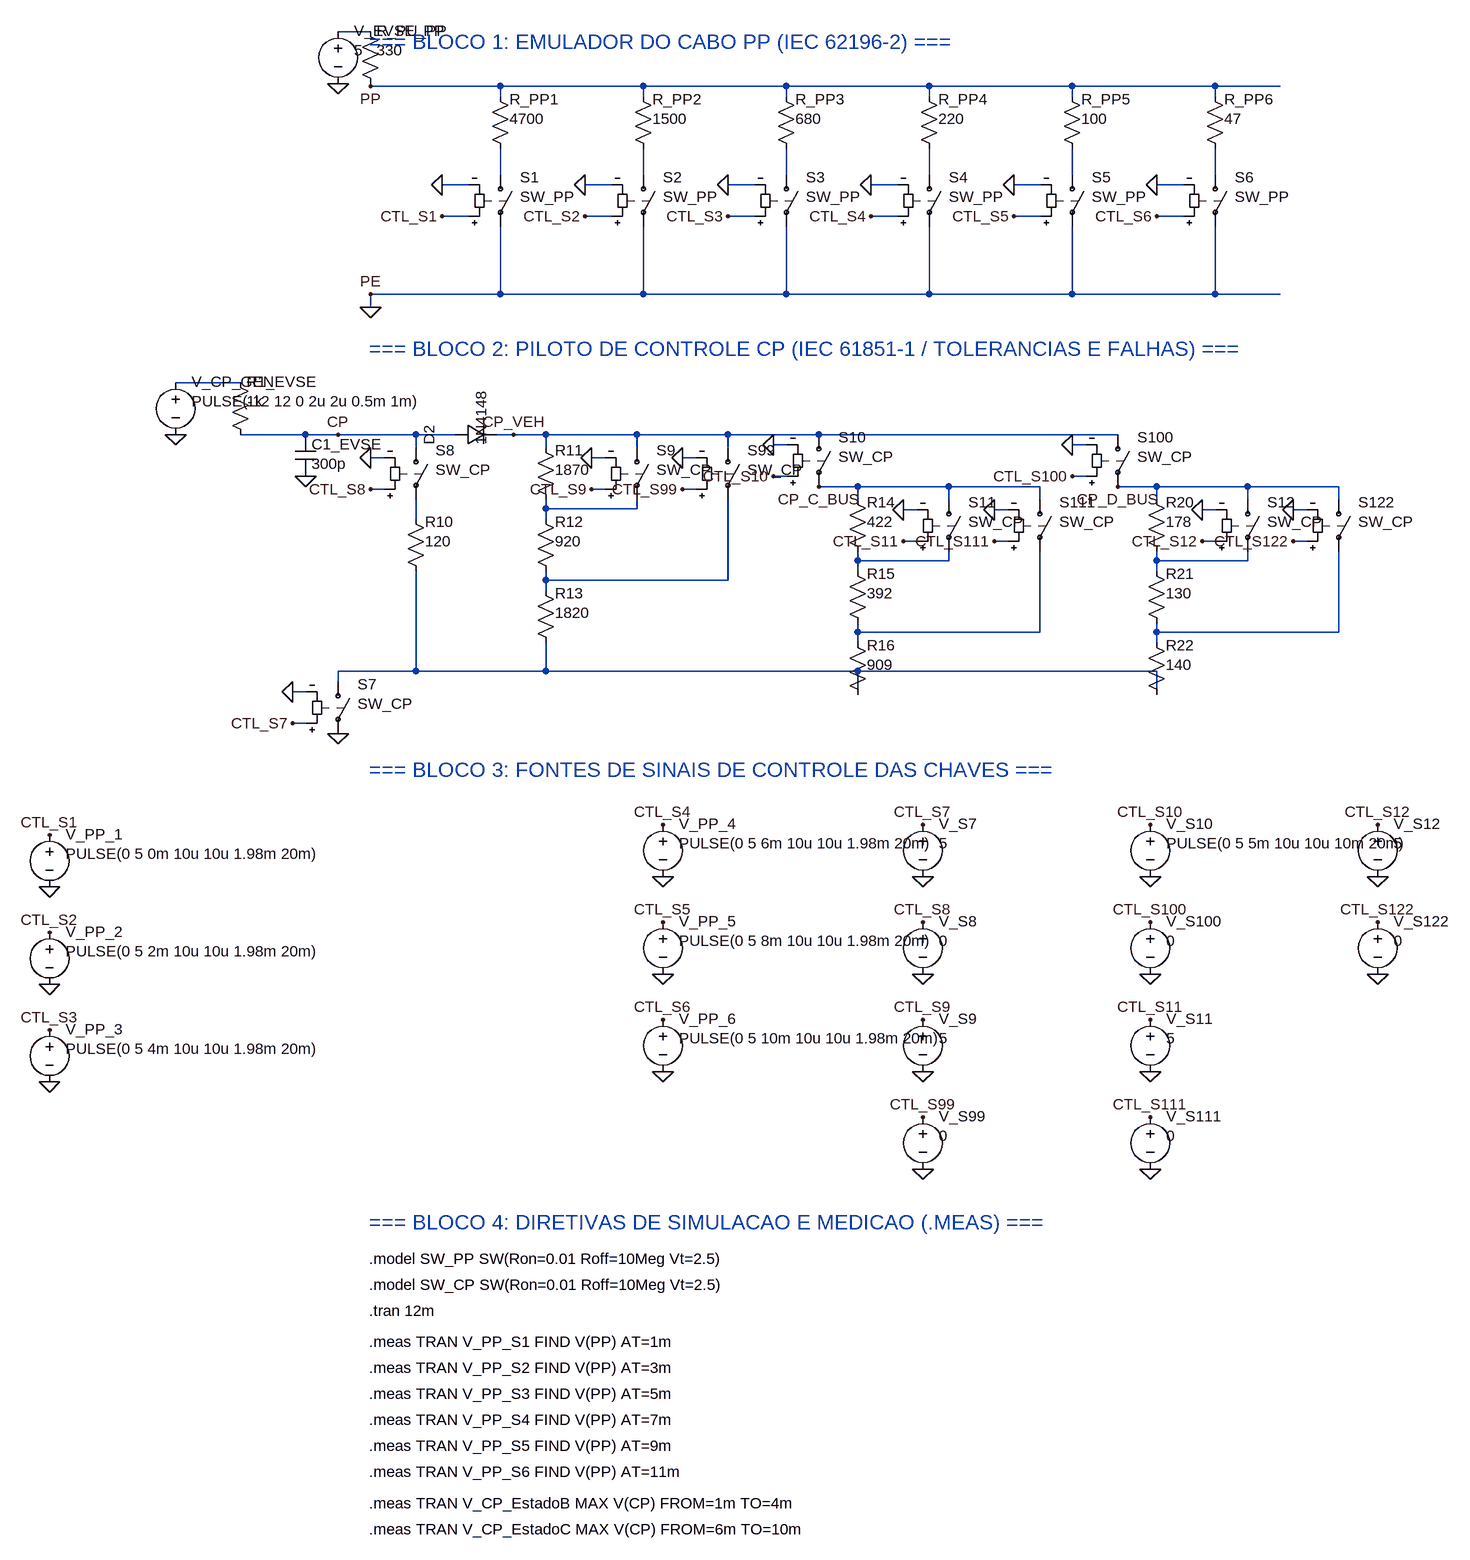
[diagram p0: schematic Teste.asc]
Teste.asc, the LTspice schematic file:
Version 4.1
SHEET 1 3600 2400
WIRE 50 16 0 16
WIRE 50 100 50 96
WIRE 250 100 50 100
WIRE 470 100 250 100
WIRE 690 100 470 100
WIRE 910 100 690 100
WIRE 1130 100 910 100
WIRE 1350 100 1130 100
WIRE 1450 100 1350 100
WIRE 250 116 250 100
WIRE 470 116 470 100
WIRE 690 116 690 100
WIRE 910 116 910 100
WIRE 1130 116 1130 100
WIRE 1350 116 1350 100
WIRE 250 236 250 196
WIRE 470 236 470 196
WIRE 690 236 690 196
WIRE 910 236 910 196
WIRE 1130 236 1130 196
WIRE 1350 236 1350 196
WIRE 202 252 160 252
WIRE 422 252 380 252
WIRE 642 252 600 252
WIRE 862 252 820 252
WIRE 1082 252 1040 252
WIRE 1302 252 1260 252
WIRE 202 300 160 300
WIRE 422 300 380 300
WIRE 642 300 600 300
WIRE 862 300 820 300
WIRE 1082 300 1040 300
WIRE 1302 300 1260 300
WIRE 250 420 250 316
WIRE 250 420 50 420
WIRE 470 420 470 316
WIRE 470 420 250 420
WIRE 690 420 690 316
WIRE 690 420 470 420
WIRE 910 420 910 316
WIRE 910 420 690 420
WIRE 1130 420 1130 316
WIRE 1130 420 910 420
WIRE 1350 420 1350 316
WIRE 1350 420 1130 420
WIRE 1450 420 1350 420
WIRE 50 440 50 420
WIRE -150 556 -250 556
WIRE -50 636 -150 636
WIRE 0 636 -50 636
WIRE 120 636 0 636
WIRE 180 636 120 636
WIRE 270 636 244 636
WIRE 320 636 270 636
WIRE 460 636 320 636
WIRE 600 636 460 636
WIRE 740 636 600 636
WIRE 1200 636 740 636
WIRE 692 652 670 652
WIRE 1152 652 1130 652
WIRE 120 656 120 636
WIRE 320 656 320 636
WIRE 460 656 460 636
WIRE 600 656 600 636
WIRE 72 672 50 672
WIRE 412 672 390 672
WIRE 552 672 530 672
WIRE 692 700 670 700
WIRE 1152 700 1130 700
WIRE 800 716 740 716
WIRE 940 716 800 716
WIRE 1080 716 940 716
WIRE 1260 716 1200 716
WIRE 1400 716 1260 716
WIRE 1540 716 1400 716
WIRE 72 720 50 720
WIRE 412 720 390 720
WIRE 552 720 530 720
WIRE 800 736 800 716
WIRE 940 736 940 716
WIRE 1080 736 1080 716
WIRE 1260 736 1260 716
WIRE 1400 736 1400 716
WIRE 1540 736 1540 716
WIRE 320 750 320 736
WIRE 460 750 460 736
WIRE 460 750 320 750
WIRE 892 752 870 752
WIRE 1032 752 1010 752
WIRE 1352 752 1330 752
WIRE 1492 752 1470 752
WIRE 120 766 120 736
WIRE 320 766 320 750
WIRE 892 800 870 800
WIRE 1032 800 1010 800
WIRE 1352 800 1330 800
WIRE 1492 800 1470 800
WIRE 800 830 800 816
WIRE 940 830 940 816
WIRE 940 830 800 830
WIRE 1260 830 1260 816
WIRE 1400 830 1400 816
WIRE 1400 830 1260 830
WIRE 800 846 800 830
WIRE 1260 846 1260 830
WIRE 320 860 320 846
WIRE 600 860 600 736
WIRE 600 860 320 860
WIRE 320 876 320 860
WIRE 800 940 800 926
WIRE 1080 940 1080 816
WIRE 1080 940 800 940
WIRE 1260 940 1260 926
WIRE 1540 940 1540 816
WIRE 1540 940 1260 940
WIRE 800 956 800 940
WIRE 1260 956 1260 940
WIRE 120 1000 120 846
WIRE 120 1000 0 1000
WIRE 320 1000 320 956
WIRE 320 1000 120 1000
WIRE 800 1000 320 1000
WIRE 1260 1000 800 1000
WIRE 0 1016 0 1000
WIRE -48 1032 -70 1032
WIRE 800 1036 800 1000
WIRE 1260 1036 1260 1000
WIRE -48 1080 -70 1080
FLAG 50 100 PP
FLAG 0 96 0
FLAG 50 420 PE
FLAG 50 440 0
FLAG 160 300 CTL_S1
FLAG 160 252 0
FLAG 380 300 CTL_S2
FLAG 380 252 0
FLAG 600 300 CTL_S3
FLAG 600 252 0
FLAG 820 300 CTL_S4
FLAG 820 252 0
FLAG 1040 300 CTL_S5
FLAG 1040 252 0
FLAG 1260 300 CTL_S6
FLAG 1260 252 0
FLAG -250 636 0
FLAG 0 636 CP
FLAG -50 700 0
FLAG 50 720 CTL_S8
FLAG 50 672 0
FLAG 270 636 CP_VEH
FLAG 0 1096 0
FLAG -70 1080 CTL_S7
FLAG -70 1032 0
FLAG 390 720 CTL_S9
FLAG 390 672 0
FLAG 530 720 CTL_S99
FLAG 530 672 0
FLAG 740 716 CP_C_BUS
FLAG 670 700 CTL_S10
FLAG 670 652 0
FLAG 1200 716 CP_D_BUS
FLAG 1130 700 CTL_S100
FLAG 1130 652 0
FLAG 870 800 CTL_S11
FLAG 870 752 0
FLAG 1010 800 CTL_S111
FLAG 1010 752 0
FLAG 1330 800 CTL_S12
FLAG 1330 752 0
FLAG 1470 800 CTL_S122
FLAG 1470 752 0
FLAG -444 1252 CTL_S1
FLAG -444 1332 0
FLAG -444 1402 CTL_S2
FLAG -444 1482 0
FLAG -444 1552 CTL_S3
FLAG -444 1632 0
FLAG 500 1236 CTL_S4
FLAG 500 1316 0
FLAG 500 1386 CTL_S5
FLAG 500 1466 0
FLAG 500 1536 CTL_S6
FLAG 500 1616 0
FLAG 900 1236 CTL_S7
FLAG 900 1316 0
FLAG 900 1386 CTL_S8
FLAG 900 1466 0
FLAG 900 1536 CTL_S9
FLAG 900 1616 0
FLAG 900 1686 CTL_S99
FLAG 900 1766 0
FLAG 1250 1236 CTL_S10
FLAG 1250 1316 0
FLAG 1250 1386 CTL_S100
FLAG 1250 1466 0
FLAG 1250 1536 CTL_S11
FLAG 1250 1616 0
FLAG 1250 1686 CTL_S111
FLAG 1250 1766 0
FLAG 1600 1236 CTL_S12
FLAG 1600 1316 0
FLAG 1600 1386 CTL_S122
FLAG 1600 1466 0
SYMBOL voltage 0 0 R0
WINDOW 0 25 15 Left 2
WINDOW 3 25 45 Left 2
SYMATTR InstName V_EVSE_PP
SYMATTR Value 5
SYMBOL res 34 0 R0
WINDOW 0 25 15 Left 2
WINDOW 3 25 45 Left 2
SYMATTR InstName R_PU_PP
SYMATTR Value 330
SYMBOL res 234 100 R0
WINDOW 0 30 20 Left 2
WINDOW 3 30 50 Left 2
SYMATTR InstName R_PP1
SYMATTR Value 4700
SYMBOL sw 250 220 R0
WINDOW 0 30 20 Left 2
WINDOW 3 30 50 Left 2
SYMATTR InstName S1
SYMATTR Value SW_PP
SYMBOL res 454 100 R0
WINDOW 0 30 20 Left 2
WINDOW 3 30 50 Left 2
SYMATTR InstName R_PP2
SYMATTR Value 1500
SYMBOL sw 470 220 R0
WINDOW 0 30 20 Left 2
WINDOW 3 30 50 Left 2
SYMATTR InstName S2
SYMATTR Value SW_PP
SYMBOL res 674 100 R0
WINDOW 0 30 20 Left 2
WINDOW 3 30 50 Left 2
SYMATTR InstName R_PP3
SYMATTR Value 680
SYMBOL sw 690 220 R0
WINDOW 0 30 20 Left 2
WINDOW 3 30 50 Left 2
SYMATTR InstName S3
SYMATTR Value SW_PP
SYMBOL res 894 100 R0
WINDOW 0 30 20 Left 2
WINDOW 3 30 50 Left 2
SYMATTR InstName R_PP4
SYMATTR Value 220
SYMBOL sw 910 220 R0
WINDOW 0 30 20 Left 2
WINDOW 3 30 50 Left 2
SYMATTR InstName S4
SYMATTR Value SW_PP
SYMBOL res 1114 100 R0
WINDOW 0 30 20 Left 2
WINDOW 3 30 50 Left 2
SYMATTR InstName R_PP5
SYMATTR Value 100
SYMBOL sw 1130 220 R0
WINDOW 0 30 20 Left 2
WINDOW 3 30 50 Left 2
SYMATTR InstName S5
SYMATTR Value SW_PP
SYMBOL res 1334 100 R0
WINDOW 0 30 20 Left 2
WINDOW 3 30 50 Left 2
SYMATTR InstName R_PP6
SYMATTR Value 47
SYMBOL sw 1350 220 R0
WINDOW 0 30 20 Left 2
WINDOW 3 30 50 Left 2
SYMATTR InstName S6
SYMATTR Value SW_PP
SYMBOL voltage -250 540 R0
WINDOW 0 25 15 Left 2
WINDOW 3 25 45 Left 2
SYMATTR InstName V_CP_GEN
SYMATTR Value PULSE(-12 12 0 2u 2u 0.5m 1m)
SYMBOL res -166 540 R0
WINDOW 0 25 15 Left 2
WINDOW 3 25 45 Left 2
SYMATTR InstName R1_EVSE
SYMATTR Value 1k
SYMBOL cap -66 636 R0
WINDOW 0 25 15 Left 2
WINDOW 3 25 45 Left 2
SYMATTR InstName C1_EVSE
SYMATTR Value 300p
SYMBOL sw 120 640 R0
WINDOW 0 30 20 Left 2
WINDOW 3 30 50 Left 2
SYMATTR InstName S8
SYMATTR Value SW_CP
SYMBOL res 104 750 R0
WINDOW 0 30 20 Left 2
WINDOW 3 30 50 Left 2
SYMATTR InstName R10
SYMATTR Value 120
SYMBOL diode 180 652 R270
WINDOW 0 0 -40 Left 2
WINDOW 3 0 40 Left 2
SYMATTR InstName D2
SYMATTR Value 1N4148
SYMBOL sw 0 1000 R0
WINDOW 0 30 20 Left 2
WINDOW 3 30 50 Left 2
SYMATTR InstName S7
SYMATTR Value SW_CP
SYMBOL res 304 640 R0
WINDOW 0 30 20 Left 2
WINDOW 3 30 50 Left 2
SYMATTR InstName R11
SYMATTR Value 1870
SYMBOL res 304 750 R0
WINDOW 0 30 20 Left 2
WINDOW 3 30 50 Left 2
SYMATTR InstName R12
SYMATTR Value 920
SYMBOL res 304 860 R0
WINDOW 0 30 20 Left 2
WINDOW 3 30 50 Left 2
SYMATTR InstName R13
SYMATTR Value 1820
SYMBOL sw 460 640 R0
WINDOW 0 30 20 Left 2
WINDOW 3 30 50 Left 2
SYMATTR InstName S9
SYMATTR Value SW_CP
SYMBOL sw 600 640 R0
WINDOW 0 30 20 Left 2
WINDOW 3 30 50 Left 2
SYMATTR InstName S99
SYMATTR Value SW_CP
SYMBOL sw 740 620 R0
WINDOW 0 30 20 Left 2
WINDOW 3 30 50 Left 2
SYMATTR InstName S10
SYMATTR Value SW_CP
SYMBOL sw 1200 620 R0
WINDOW 0 30 20 Left 2
WINDOW 3 30 50 Left 2
SYMATTR InstName S100
SYMATTR Value SW_CP
SYMBOL res 784 720 R0
WINDOW 0 30 20 Left 2
WINDOW 3 30 50 Left 2
SYMATTR InstName R14
SYMATTR Value 422
SYMBOL res 784 830 R0
WINDOW 0 30 20 Left 2
WINDOW 3 30 50 Left 2
SYMATTR InstName R15
SYMATTR Value 392
SYMBOL res 784 940 R0
WINDOW 0 30 20 Left 2
WINDOW 3 30 50 Left 2
SYMATTR InstName R16
SYMATTR Value 909
SYMBOL sw 940 720 R0
WINDOW 0 30 20 Left 2
WINDOW 3 30 50 Left 2
SYMATTR InstName S11
SYMATTR Value SW_CP
SYMBOL sw 1080 720 R0
WINDOW 0 30 20 Left 2
WINDOW 3 30 50 Left 2
SYMATTR InstName S111
SYMATTR Value SW_CP
SYMBOL res 1244 720 R0
WINDOW 0 30 20 Left 2
WINDOW 3 30 50 Left 2
SYMATTR InstName R20
SYMATTR Value 178
SYMBOL res 1244 830 R0
WINDOW 0 30 20 Left 2
WINDOW 3 30 50 Left 2
SYMATTR InstName R21
SYMATTR Value 130
SYMBOL res 1244 940 R0
WINDOW 0 30 20 Left 2
WINDOW 3 30 50 Left 2
SYMATTR InstName R22
SYMATTR Value 140
SYMBOL sw 1400 720 R0
WINDOW 0 30 20 Left 2
WINDOW 3 30 50 Left 2
SYMATTR InstName S12
SYMATTR Value SW_CP
SYMBOL sw 1540 720 R0
WINDOW 0 30 20 Left 2
WINDOW 3 30 50 Left 2
SYMATTR InstName S122
SYMATTR Value SW_CP
SYMBOL voltage -444 1236 R0
WINDOW 0 25 15 Left 2
WINDOW 3 25 45 Left 2
SYMATTR InstName V_PP_1
SYMATTR Value PULSE(0 5 0m 10u 10u 1.98m 20m)
SYMBOL voltage -444 1386 R0
WINDOW 0 25 15 Left 2
WINDOW 3 25 45 Left 2
SYMATTR InstName V_PP_2
SYMATTR Value PULSE(0 5 2m 10u 10u 1.98m 20m)
SYMBOL voltage -444 1536 R0
WINDOW 0 25 15 Left 2
WINDOW 3 25 45 Left 2
SYMATTR InstName V_PP_3
SYMATTR Value PULSE(0 5 4m 10u 10u 1.98m 20m)
SYMBOL voltage 500 1220 R0
WINDOW 0 25 15 Left 2
WINDOW 3 25 45 Left 2
SYMATTR InstName V_PP_4
SYMATTR Value PULSE(0 5 6m 10u 10u 1.98m 20m)
SYMBOL voltage 500 1370 R0
WINDOW 0 25 15 Left 2
WINDOW 3 25 45 Left 2
SYMATTR InstName V_PP_5
SYMATTR Value PULSE(0 5 8m 10u 10u 1.98m 20m)
SYMBOL voltage 500 1520 R0
WINDOW 0 25 15 Left 2
WINDOW 3 25 45 Left 2
SYMATTR InstName V_PP_6
SYMATTR Value PULSE(0 5 10m 10u 10u 1.98m 20m)
SYMBOL voltage 900 1220 R0
WINDOW 0 25 15 Left 2
WINDOW 3 25 45 Left 2
SYMATTR InstName V_S7
SYMATTR Value 5
SYMBOL voltage 900 1370 R0
WINDOW 0 25 15 Left 2
WINDOW 3 25 45 Left 2
SYMATTR InstName V_S8
SYMATTR Value 0
SYMBOL voltage 900 1520 R0
WINDOW 0 25 15 Left 2
WINDOW 3 25 45 Left 2
SYMATTR InstName V_S9
SYMATTR Value 5
SYMBOL voltage 900 1670 R0
WINDOW 0 25 15 Left 2
WINDOW 3 25 45 Left 2
SYMATTR InstName V_S99
SYMATTR Value 0
SYMBOL voltage 1250 1220 R0
WINDOW 0 25 15 Left 2
WINDOW 3 25 45 Left 2
SYMATTR InstName V_S10
SYMATTR Value PULSE(0 5 5m 10u 10u 10m 20m)
SYMBOL voltage 1250 1370 R0
WINDOW 0 25 15 Left 2
WINDOW 3 25 45 Left 2
SYMATTR InstName V_S100
SYMATTR Value 0
SYMBOL voltage 1250 1520 R0
WINDOW 0 25 15 Left 2
WINDOW 3 25 45 Left 2
SYMATTR InstName V_S11
SYMATTR Value 5
SYMBOL voltage 1250 1670 R0
WINDOW 0 25 15 Left 2
WINDOW 3 25 45 Left 2
SYMATTR InstName V_S111
SYMATTR Value 0
SYMBOL voltage 1600 1220 R0
WINDOW 0 25 15 Left 2
WINDOW 3 25 45 Left 2
SYMATTR InstName V_S12
SYMATTR Value 5
SYMBOL voltage 1600 1370 R0
WINDOW 0 25 15 Left 2
WINDOW 3 25 45 Left 2
SYMATTR InstName V_S122
SYMATTR Value 0
TEXT 48 32 Left 3 ;=== BLOCO 1: EMULADOR DO CABO PP (IEC 62196-2) ===
TEXT 48 504 Left 3 ;=== BLOCO 2: PILOTO DE CONTROLE CP (IEC 61851-1 / TOLERANCIAS E FALHAS) ===
TEXT 48 1152 Left 3 ;=== BLOCO 3: FONTES DE SINAIS DE CONTROLE DAS CHAVES ===
TEXT 48 1848 Left 3 ;=== BLOCO 4: DIRETIVAS DE SIMULACAO E MEDICAO (.MEAS) ===
TEXT 48 1904 Left 2 !.model SW_PP SW(Ron=0.01 Roff=10Meg Vt=2.5)
TEXT 48 1944 Left 2 !.model SW_CP SW(Ron=0.01 Roff=10Meg Vt=2.5)
TEXT 48 1984 Left 2 !.tran 12m
TEXT 48 2032 Left 2 !.meas TRAN V_PP_S1 FIND V(PP) AT=1m
TEXT 48 2072 Left 2 !.meas TRAN V_PP_S2 FIND V(PP) AT=3m
TEXT 48 2112 Left 2 !.meas TRAN V_PP_S3 FIND V(PP) AT=5m
TEXT 48 2152 Left 2 !.meas TRAN V_PP_S4 FIND V(PP) AT=7m
TEXT 48 2192 Left 2 !.meas TRAN V_PP_S5 FIND V(PP) AT=9m
TEXT 48 2232 Left 2 !.meas TRAN V_PP_S6 FIND V(PP) AT=11m
TEXT 48 2280 Left 2 !.meas TRAN V_CP_EstadoB MAX V(CP) FROM=1m TO=4m
TEXT 48 2320 Left 2 !.meas TRAN V_CP_EstadoC MAX V(CP) FROM=6m TO=10m

The netlist it stands for:
* Teste.asc
V_EVSE_PP N001 0 5
R_PU_PP N001 PP 330
R_PP1 PP N002 4700
S1 N002 0 CTL_S1 0 SW_PP
R_PP2 PP N003 1500
S2 N003 0 CTL_S2 0 SW_PP
R_PP3 PP N004 680
S3 N004 0 CTL_S3 0 SW_PP
R_PP4 PP N005 220
S4 N005 0 CTL_S4 0 SW_PP
R_PP5 PP N006 100
S5 N006 0 CTL_S5 0 SW_PP
R_PP6 PP N007 47
S6 N007 0 CTL_S6 0 SW_PP
V_CP_GEN N008 0 PULSE(-12 12 0 2u 2u 0.5m 1m)
R1_EVSE N008 CP 1k
C1_EVSE CP 0 300p
S8 CP N010 CTL_S8 0 SW_CP
R10 N010 N016 120
D2 CP CP_VEH 1N4148
S7 N016 0 CTL_S7 0 SW_CP
R11 CP_VEH N009 1870
R12 N009 N013 920
R13 N013 N016 1820
S9 CP_VEH N009 CTL_S9 0 SW_CP
S99 CP_VEH N013 CTL_S99 0 SW_CP
S10 CP_VEH CP_C_BUS CTL_S10 0 SW_CP
S100 CP_VEH CP_D_BUS CTL_S100 0 SW_CP
R14 CP_C_BUS N011 422
R15 N011 N014 392
R16 N014 N016 909
S11 CP_C_BUS N011 CTL_S11 0 SW_CP
S111 CP_C_BUS N014 CTL_S111 0 SW_CP
R20 CP_D_BUS N012 178
R21 N012 N015 130
R22 N015 N016 140
S12 CP_D_BUS N012 CTL_S12 0 SW_CP
S122 CP_D_BUS N015 CTL_S122 0 SW_CP
V_PP_1 CTL_S1 0 PULSE(0 5 0m 10u 10u 1.98m 20m)
V_PP_2 CTL_S2 0 PULSE(0 5 2m 10u 10u 1.98m 20m)
V_PP_3 CTL_S3 0 PULSE(0 5 4m 10u 10u 1.98m 20m)
V_PP_4 CTL_S4 0 PULSE(0 5 6m 10u 10u 1.98m 20m)
V_PP_5 CTL_S5 0 PULSE(0 5 8m 10u 10u 1.98m 20m)
V_PP_6 CTL_S6 0 PULSE(0 5 10m 10u 10u 1.98m 20m)
V_S7 CTL_S7 0 5
V_S8 CTL_S8 0 0
V_S9 CTL_S9 0 5
V_S99 CTL_S99 0 0
V_S10 CTL_S10 0 PULSE(0 5 5m 10u 10u 10m 20m)
V_S100 CTL_S100 0 0
V_S11 CTL_S11 0 5
V_S111 CTL_S111 0 0
V_S12 CTL_S12 0 5
V_S122 CTL_S122 0 0
.model D D
.lib standard.dio
* === BLOCO 1: EMULADOR DO CABO PP (IEC 62196-2) ===
* === BLOCO 2: PILOTO DE CONTROLE CP (IEC 61851-1 / TOLERANCIAS E FALHAS) ===
* === BLOCO 3: FONTES DE SINAIS DE CONTROLE DAS CHAVES ===
* === BLOCO 4: DIRETIVAS DE SIMULACAO E MEDICAO (.MEAS) ===
.model SW_PP SW(Ron=0.01 Roff=10Meg Vt=2.5)
.model SW_CP SW(Ron=0.01 Roff=10Meg Vt=2.5)
.tran 12m
.meas TRAN V_PP_S1 FIND V(PP) AT=1m
.meas TRAN V_PP_S2 FIND V(PP) AT=3m
.meas TRAN V_PP_S3 FIND V(PP) AT=5m
.meas TRAN V_PP_S4 FIND V(PP) AT=7m
.meas TRAN V_PP_S5 FIND V(PP) AT=9m
.meas TRAN V_PP_S6 FIND V(PP) AT=11m
.meas TRAN V_CP_EstadoB MAX V(CP) FROM=1m TO=4m
.meas TRAN V_CP_EstadoC MAX V(CP) FROM=6m TO=10m
.backanno
.end